# Altium schematic sheet Power.SchDoc
size A4
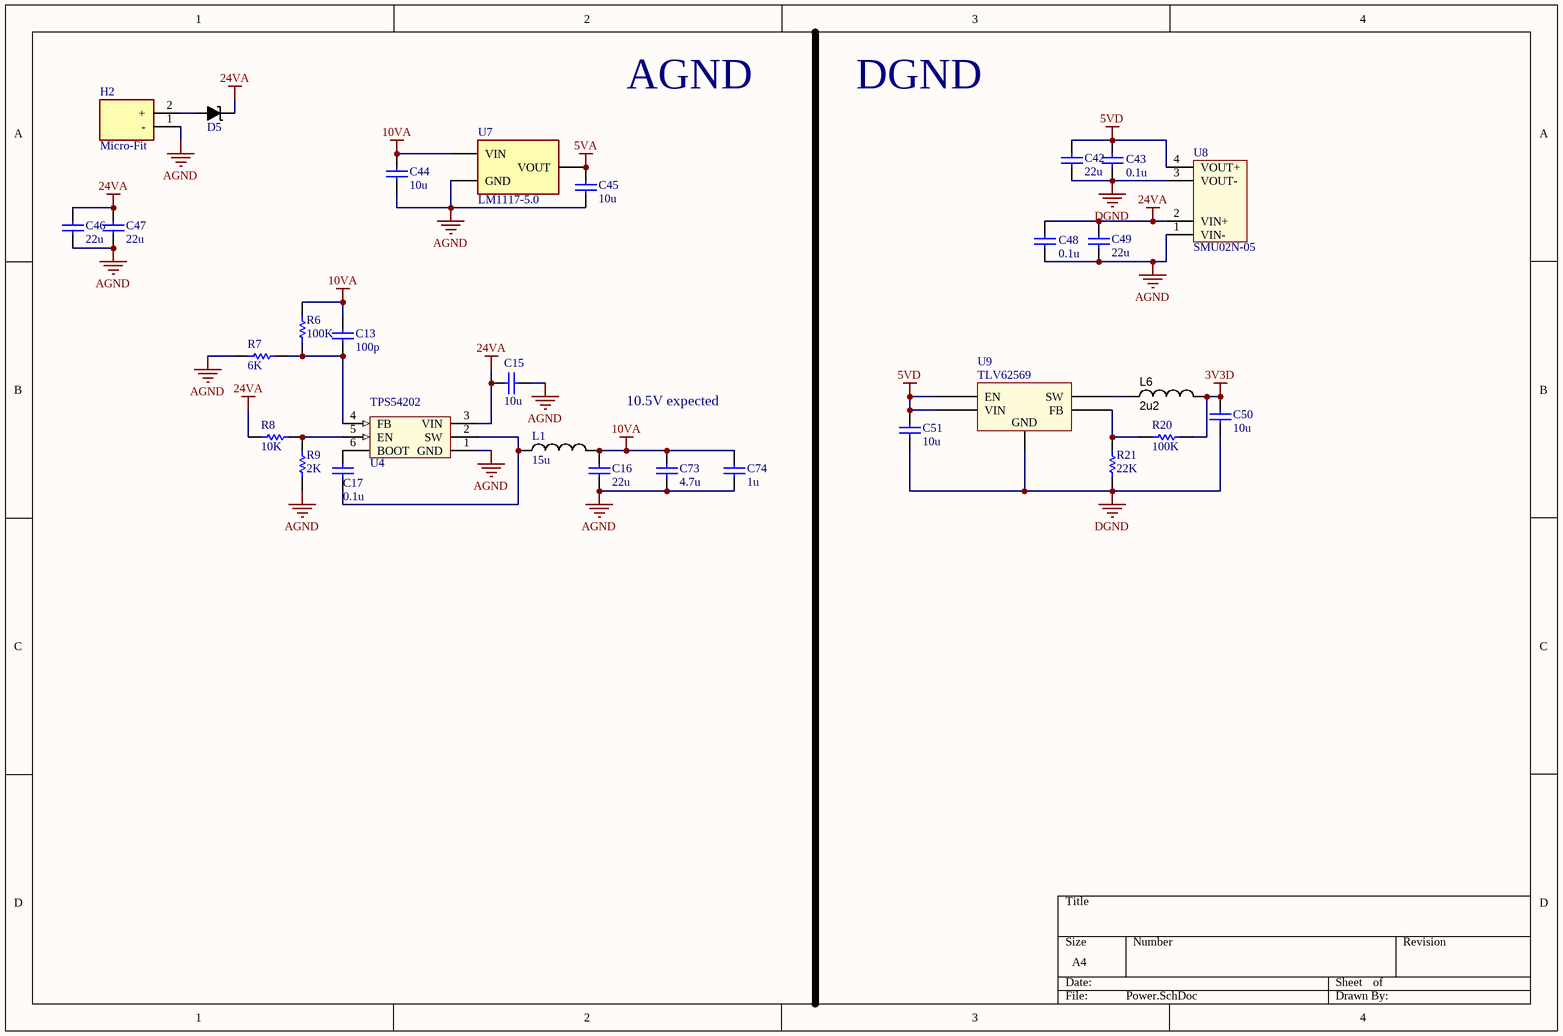
[diagram p0: Power.SchDoc]

## Parts
C13  value 100p  [CAPC1608X90N]  (hidden comment: Cap)
C15  value 10u  [CAPC2012X135N]  (hidden comment: Cap)
C16  value 22u  [CAPC2012X135N]  (hidden comment: Cap)
C17  value 0.1u  [CAPC1608X90N]  (hidden comment: Cap)
C42  value 22u  [CAPC2012X135N]  (hidden comment: Cap)
C43  value 0.1u  [CAPC1608X90N]  (hidden comment: Cap)
C44  value 10u  [CAPC2012X135N]  (hidden comment: Cap)
C45  value 10u  [CAPC2012X135N]  (hidden comment: Cap)
C46  value 22u  [CAPC2012X135N]  (hidden comment: Cap)
C47  value 22u  [CAPC2012X135N]  (hidden comment: Cap)
C48  value 0.1u  [CAPC1608X90N]  (hidden comment: Cap)
C49  value 22u  [CAPC2012X135N]  (hidden comment: Cap)
C50  value 10u  [CAPC2012X135N]  (hidden comment: Cap)
C51  value 10u  [CAPC2012X135N]  (hidden comment: Cap)
C73  value 4.7u  [CAPC1608X90N]  (hidden comment: Cap)
C74  value 1u  [CAPC1608X90N]  (hidden comment: Cap)
D5  SS24  [DO-214AA]  (value not drawn)
H2  Micro-Fit  [430450212]
L1  value 15u  [INDC_5.5x5.3x3]  (hidden comment: 15uH inductor)
L6  value 2u2  [INDM3225X240N]  (hidden comment: inductor)
R6  value 100K  [RESC1608X55N]  (hidden comment: Res1)
R7  value 6K  [RESC1608X55N]  (hidden comment: Res1)
R8  value 10K  [RESC1608X55N]  (hidden comment: Res1)
R9  value 2K  [RESC1608X55N]  (hidden comment: Res1)
R20  value 100K  [RESC2012X70N]  (hidden comment: Res1)
R21  value 22K  [RESC2012X70N]  (hidden comment: Res1)
U4  TPS54202  [SOT23-6]
U7  LM1117-5.0  [SOT223]
U8  SMU02N-05  [SMU02N]
U9  TLV62569  [SOT23-5]

## Nets
3V3D: C50.2 L6.2 R20.1
5VA: C45.2 U7.2(VOUT) U7.4(VOUT)
5VD: C42.2 C43.2 C51.2 U8.4(VOUT+) U9.1(EN) U9.4(VIN)
10VA: C13.2 C16.2 C44.2 C73.2 C74.2 L1.2 R6.2 U7.3(VIN)
24VA: C15.1 C46.2 C47.2 C48.2 C49.2 D5.K(Cathode) R8.1 U4.3(VIN) U8.2(VIN+)
AGND: C15.2 C16.1 C44.1 C45.1 C46.1 C47.1 C48.1 C49.1 C73.1 C74.1 H2.1(-) R7.2 R9.1 U4.1(GND) U7.1(GND) U8.1(VIN-)
DGND: C42.1 C43.1 C50.1 C51.1 R21.2 U8.3(VOUT-) U9.2(GND)
NetC13_1: C13.1 R6.1 R7.1 U4.4(FB)
NetC17_1: C17.1 L1.1 U4.2(SW)
NetC17_2: C17.2 U4.6(BOOT)
NetD5_A: D5.A(Anode) H2.2(+)
NetL6_1: L6.1 U9.3(SW)
NetR8_2: R8.2 R9.2 U4.5(EN)
NetR20_2: R20.2 R21.1 U9.5(FB)

## Notes on the sheet
- AGND
- DGND
- 10.5V expected

## Library data of the parts
C13 C15-C17 C42-C51 C73 C74 = Cap: Capacitor; Published: 8-Jun-2000; LatestRevisionDate: 17-Jul-2002; LatestRevisionNote: Re-released for DXP Platform.; PackageReference: RAD-0.3; Publisher: Altium Limited; PackageDescription: Radial Cap, Thru-Hole; 2 Leads; 0.3 in Pin Spacing
D5 = SS24: 2.0A SURFACE MOUNT SCHOTTKY BARRIER RECTIFIER; Voltage: 40V; Current: 2A
H2 = Molex_430450212: Micro fit series from MOLEX. 2P. 8.6A
L1 = INDC_MPX1D0530L150: 15uH inductor with 2A saturation current. Dimension is 5.5 * 5.2 * 3 mm^3; Saturation Current: 2A
L6 = INDC: IHLP SMD 4040; link: http://www.mouser.hk/ProductDetail/Panasonic/ETQ-P5M4R7YFC/?qs=sGAEpiMZZMsg%252by3WlYCkUx1BJssUTVH58rrEHsPkNus%3d
R6-R9 R20 R21 = Res1: Resistor; Published: 8-Jun-2000; LatestRevisionDate: 17-Jul-2002; LatestRevisionNote: Re-released for DXP Platform.; PackageReference: AXIAL-0.3; Publisher: Altium Limited; PackageDescription: Axial Device, Thru-Hole; 2 Leads; 0.3 in Pin Spacing
U4 = TPS54202: 4.5-28V input 2A output step down, EMI Friendly Synchronous Step Down Converter; Vin(max): 28V; Vin(min): 4.5V; Currrent: 2A
U7 = LM1117-5.0: 1117 LDO with fixed 5V output, 800mA current
U8 = SMU02N-05: isolated 24V to 5V
U9 = TLV62569: 2-A High Efficiency Synchronous Buck Converter in SOT Package; Manufacturer: TI; Vin: 2.5-5.5V; Iout(max): 2A